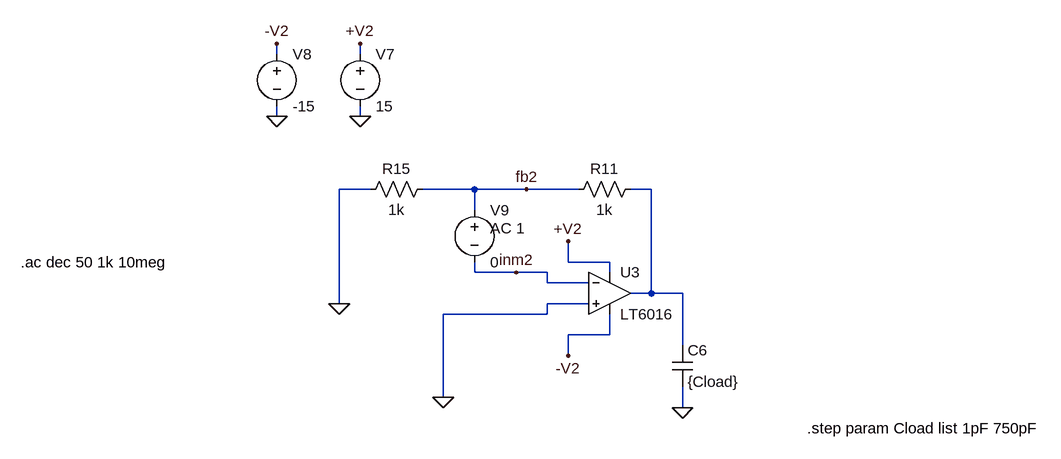
[diagram p0: schematic amp02stab.asc]
amp02stab.asc, the LTspice schematic file:
Version 4
SHEET 1 2180 732
WIRE 992 -1072 992 -1088
WIRE 1120 -1072 1120 -1088
WIRE 992 -976 992 -992
WIRE 1120 -976 1120 -992
WIRE 1136 -864 1088 -864
WIRE 1296 -864 1216 -864
WIRE 1376 -864 1296 -864
WIRE 1456 -864 1376 -864
WIRE 1568 -864 1536 -864
WIRE 1296 -832 1296 -864
WIRE 1440 -752 1440 -784
WIRE 1504 -752 1440 -752
WIRE 1296 -736 1296 -752
WIRE 1360 -736 1296 -736
WIRE 1408 -736 1360 -736
WIRE 1504 -736 1504 -752
WIRE 1408 -720 1408 -736
WIRE 1472 -720 1408 -720
WIRE 1568 -704 1568 -864
WIRE 1568 -704 1536 -704
WIRE 1616 -704 1568 -704
WIRE 1088 -688 1088 -864
WIRE 1472 -688 1408 -688
WIRE 1408 -672 1408 -688
WIRE 1408 -672 1248 -672
WIRE 1504 -640 1504 -672
WIRE 1504 -640 1440 -640
WIRE 1616 -624 1616 -704
WIRE 1440 -608 1440 -640
WIRE 1248 -544 1248 -672
WIRE 1616 -528 1616 -560
FLAG 1120 -976 0
FLAG 1440 -784 +V2
FLAG 1120 -1088 +V2
FLAG 1440 -608 -V2
FLAG 992 -976 0
FLAG 992 -1088 -V2
FLAG 1248 -544 0
FLAG 1616 -528 0
FLAG 1376 -864 fb2
FLAG 1360 -736 inm2
FLAG 1088 -688 0
SYMBOL voltage 1120 -1088 R0
WINDOW 123 0 0 Left 2
WINDOW 39 0 0 Left 2
SYMATTR InstName V7
SYMATTR Value 15
SYMBOL voltage 992 -1088 R0
WINDOW 123 0 0 Left 2
WINDOW 39 0 0 Left 2
SYMATTR InstName V8
SYMATTR Value -15
SYMBOL res 1552 -880 R90
WINDOW 0 0 56 VBottom 2
WINDOW 3 32 56 VTop 2
SYMATTR InstName R11
SYMATTR Value 1k
SYMBOL cap 1600 -624 R0
SYMATTR InstName C6
SYMATTR Value {Cload}
SYMBOL voltage 1296 -848 R0
WINDOW 123 24 44 Left 2
WINDOW 39 0 0 Left 2
SYMATTR InstName V9
SYMATTR Value 0
SYMATTR Value2 AC 1
SYMBOL res 1232 -880 R90
WINDOW 0 0 56 VBottom 2
WINDOW 3 32 56 VTop 2
SYMATTR InstName R15
SYMATTR Value 1k
SYMBOL Opamps\\LT6016 1504 -704 R0
SYMATTR InstName U3
TEXT 598 -752 Left 2 !.ac dec 50 1k 10meg
TEXT 1808 -496 Left 2 !.step param Cload list 1pF 750pF

The netlist it stands for:
* amp02stab.asc
V7 +V2 0 15
V8 -V2 0 -15
R11 N001 fb2 1k
C6 N001 0 {Cload}
V9 fb2 inm2 0 AC 1
R15 fb2 0 1k
* U3: LT6016 (symbol Opamps\LT6016 not available, pins judged from their places): In+=0 In-=inm2 V+=+V2 V-=-V2 OUT=N001
.ac dec 50 1k 10meg
.step param Cload list 1pF 750pF
.backanno
.end